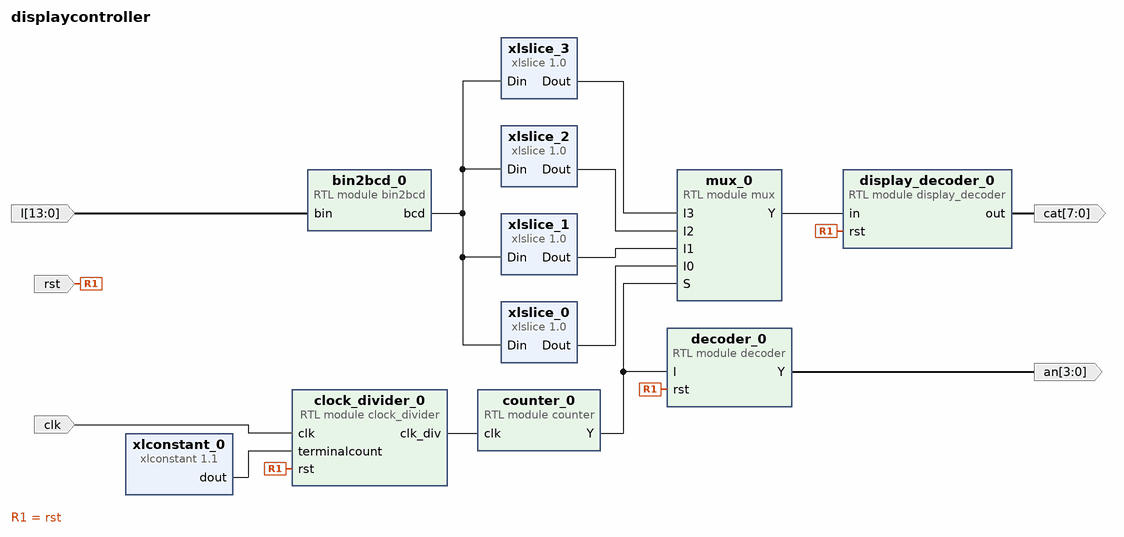
[diagram p0: block diagram of the top level]
# Vivado block design displaycontroller, xc7z007sclg400-1, Vivado 2024.1.1
create_bd_design displaycontroller

create_bd_port -dir I -from 13 -to 0 I
create_bd_port -dir I clk
create_bd_port -dir I rst
create_bd_port -dir O -from 7 -to 0 cat
create_bd_port -dir O -from 3 -to 0 an

create_bd_cell -type module -reference bin2bcd bin2bcd_0
create_bd_cell -type module -reference clock_divider clock_divider_0
create_bd_cell -type ip -vlnv xilinx.com:ip:xlslice:1.0 xlslice_0
set_property -dict {CONFIG.DIN_FROM 3 CONFIG.DIN_WIDTH 16} [get_bd_cells xlslice_0]
create_bd_cell -type ip -vlnv xilinx.com:ip:xlslice:1.0 xlslice_1
set_property -dict {CONFIG.DIN_FROM 7 CONFIG.DIN_TO 4 CONFIG.DIN_WIDTH 16} [get_bd_cells xlslice_1]
create_bd_cell -type ip -vlnv xilinx.com:ip:xlslice:1.0 xlslice_2
set_property -dict {CONFIG.DIN_FROM 11 CONFIG.DIN_TO 8 CONFIG.DIN_WIDTH 16} [get_bd_cells xlslice_2]
create_bd_cell -type ip -vlnv xilinx.com:ip:xlslice:1.0 xlslice_3
set_property -dict {CONFIG.DIN_FROM 15 CONFIG.DIN_TO 12 CONFIG.DIN_WIDTH 16} [get_bd_cells xlslice_3]
create_bd_cell -type module -reference counter counter_0
create_bd_cell -type module -reference mux mux_0
create_bd_cell -type module -reference display_decoder display_decoder_0
create_bd_cell -type module -reference decoder decoder_0
create_bd_cell -type ip -vlnv xilinx.com:ip:xlconstant:1.1 xlconstant_0
set_property -dict {CONFIG.CONST_VAL 19999 CONFIG.CONST_WIDTH 17} [get_bd_cells xlconstant_0]

# ---- connections ----

connect_bd_net [get_bd_ports I] [get_bd_pins bin2bcd_0/bin]
connect_bd_net [get_bd_pins bin2bcd_0/bcd] \
  [get_bd_pins xlslice_0/Din] [get_bd_pins xlslice_1/Din] [get_bd_pins xlslice_2/Din] [get_bd_pins xlslice_3/Din]
connect_bd_net [get_bd_ports clk] [get_bd_pins clock_divider_0/clk]
connect_bd_net [get_bd_pins clock_divider_0/clk_div] [get_bd_pins counter_0/clk]
connect_bd_net [get_bd_pins counter_0/Y] [get_bd_pins mux_0/S] [get_bd_pins decoder_0/I]
connect_bd_net [get_bd_pins decoder_0/Y] [get_bd_ports an]
connect_bd_net [get_bd_pins display_decoder_0/out] [get_bd_ports cat]
connect_bd_net [get_bd_pins mux_0/Y] [get_bd_pins display_decoder_0/in]
connect_bd_net [get_bd_ports rst] [get_bd_pins clock_divider_0/rst] [get_bd_pins decoder_0/rst] [get_bd_pins display_decoder_0/rst]
connect_bd_net [get_bd_pins xlconstant_0/dout] [get_bd_pins clock_divider_0/terminalcount]
connect_bd_net [get_bd_pins xlslice_0/Dout] [get_bd_pins mux_0/I0]
connect_bd_net [get_bd_pins xlslice_1/Dout] [get_bd_pins mux_0/I1]
connect_bd_net [get_bd_pins xlslice_2/Dout] [get_bd_pins mux_0/I2]
connect_bd_net [get_bd_pins xlslice_3/Dout] [get_bd_pins mux_0/I3]

validate_bd_design
save_bd_design
